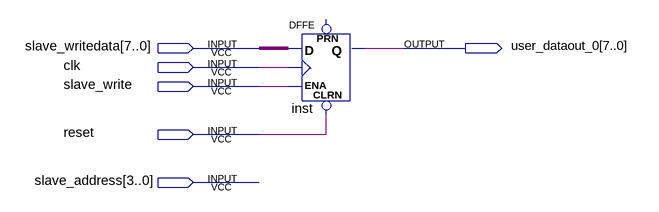
[diagram p0: schematic sheet]
// Quartus schematic dinges.bdf as structural Verilog: 1 symbols, 6 pins
module dinges (
  input  [7:0] slave_writedata,
  input  clk,
  input  slave_write,
  input  reset,
  input  [3:0] slave_address,
  output [7:0] user_dataout_0
);

  wire inst_q;

  DFFE inst[7:0] (.CLRN(reset), .D(slave_writedata), .CLK(clk), .ENA(slave_write), .Q(inst_q));  // open: PRN
endmodule
